# EAGLE design Controller Board (EAGLE 8.0.1)
CNAME: Rocket Igniter; CREVISION: 1.0; DESIGNER: J Hope
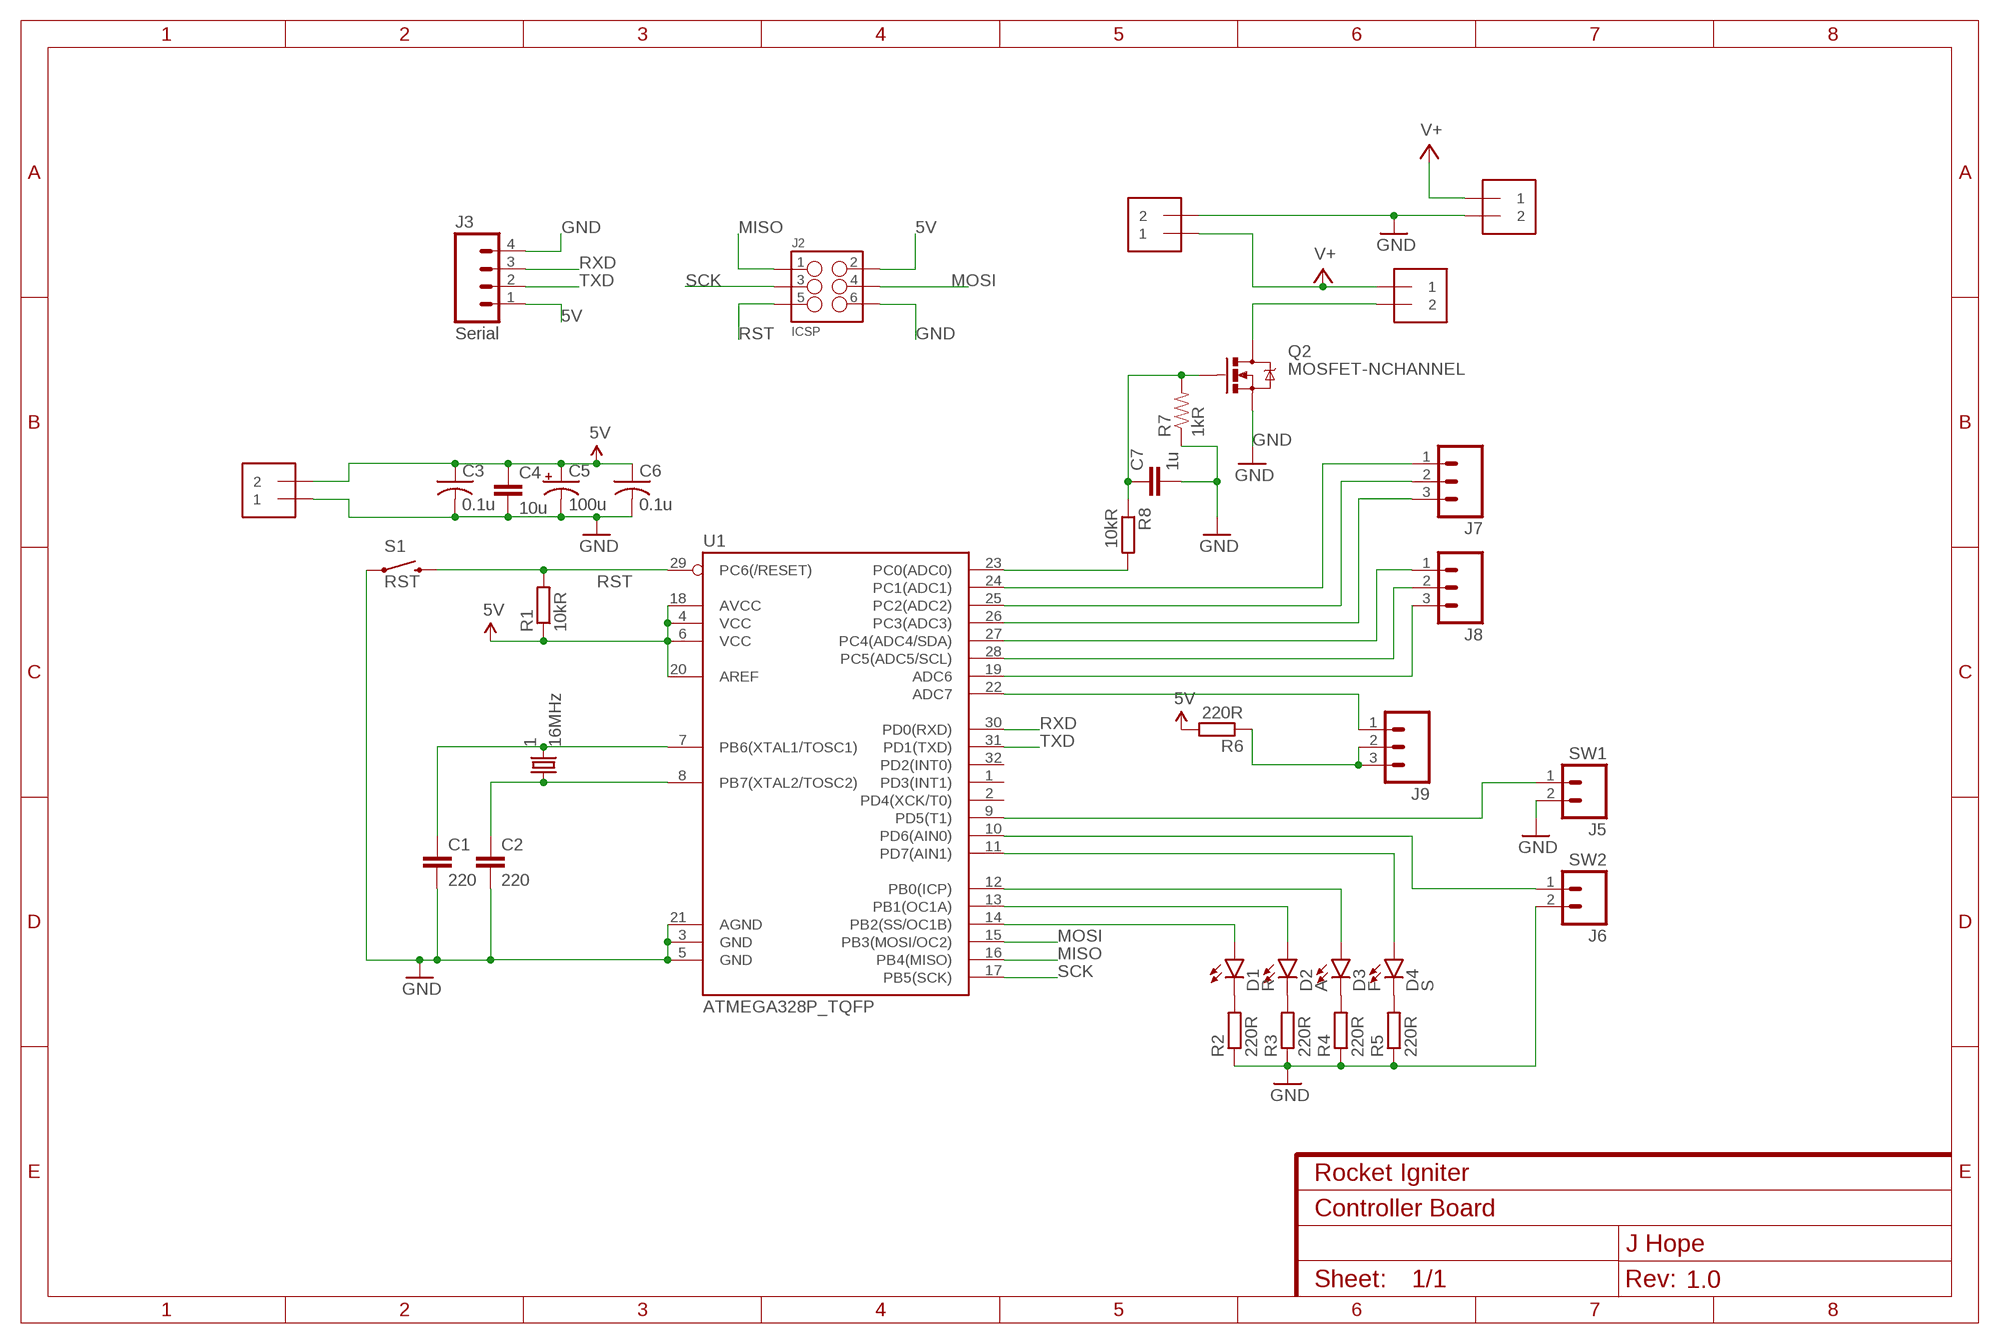
[diagram p0: schematic, sheet 1]

## Parts
1  16MHz  CRYSTAL4  [CRYSTAL-OSC-SMD-5X3.2]
C1  220  C-EUC0603  [C0603]
C2  220  C-EUC0603  [C0603]
C3  0.1u  C-USC0603  [C0603]
C4  10u  CAP0603-CAP  [0603-CAP]
C5  100u  CAP_POLD  [PANASONIC_D]
C6  0.1u  C-USC0603  [C0603]
C7  1u  CAP0603-CAP  [0603-CAP]
D1  R  LED5MM  [LED5MM]
D2  A  LED5MM  [LED5MM]
D3  F  LED5MM  [LED5MM]
D4  S  LED5MM  [LED5MM]
FAN  FAN  1X2-3.5MM  [1X2-3.5MM]
HV  HV  1X2-3.5MM  [1X2-3.5MM]
J2  ICSP  M03X22X3_SILK_MALE_PTH  [2X3]
J3  Serial  M04PTH  [1X04]
J5  SW1  M02SMALLPOLAR  [1X02_POLAR]
J6  SW2  M02SMALLPOLAR  [1X02_POLAR]
J7  M03PTH  [1X03]
J8  M03PTH  [1X03]
J9  M03PTH  [1X03]
POWER  +5V  1X2-3.5MM  [1X2-3.5MM]
Q2  MOSFET-NCHANNEL  MOSFET-NCHANNELFQP30N06L  [TO220V]
R1  10kR  R-EU_R0603  [R0603]
R2  220R  R-EU_R0603  [R0603]
R3  220R  R-EU_R0603  [R0603]
R4  220R  R-EU_R0603  [R0603]
R5  220R  R-EU_R0603  [R0603]
R6  220R  R-EU_R0603  [R0603]
R7  1kR  RESISTOR0603  [0603-RES]
R8  10kR  R-EU_R0603  [R0603]
S1  RST  SWITCH-MOMENTARY-2SMD-1101NE  [TACTILE-SWITCH-1101NE]
U1  ATMEGA328P_TQFP  [TQFP32-08]
V+  V+  1X2-3.5MM  [1X2-3.5MM]

## Nets
5V: C3.1 C4.1 C5.+ C6.1 J2.2 J3.1 POWER.2 R1.1 R6.2 U1.4(VCC) U1.6(VCC) U1.18(AVCC) U1.20(AREF)
A: J7.1 U1.24(PC1(ADC1))
B: J7.2 U1.25(PC2(ADC2))
C: J7.3 U1.26(PC3(ADC3))
D: J8.1 U1.27(PC4(ADC4/SDA))
E: J8.2 U1.28(PC5(ADC5/SCL))
F: J8.3 U1.19(ADC6)
G: J9.1 U1.22(ADC7)
GND: C1.2 C2.2 C3.2 C4.2 C5.- C6.2 C7.2 FAN.2 J2.6 J3.4 J5.2 J6.2 POWER.1 Q2.3(S) R2.1 R3.1 R4.1 R5.1 R7.1 S1.1 U1.3(GND) U1.5(GND) U1.21(AGND) V+.2
MISO: J2.1 U1.16(PB4(MISO))
MOSI: J2.4 U1.15(PB3(MOSI/OC2))
N$1: 1.3 C1.1 U1.7(PB6(XTAL1/TOSC1))
N$2: 1.1 C2.1 U1.8(PB7(XTAL2/TOSC2))
N$3: D1.K(C) R2.2
N$4: D2.K(C) R3.2
N$5: D3.K(C) R4.2
N$6: D1.A U1.14(PB2(SS/OC1B))
N$7: D2.A U1.13(PB1(OC1A))
N$8: D3.A U1.12(PB0(ICP))
N$9: R8.2 U1.23(PC0(ADC0))
N$10: C7.1 Q2.1(G) R7.2 R8.1
N$17: D4.K(C) R5.2
N$18: D4.A U1.11(PD7(AIN1))
N$19: HV.2 Q2.2(D)
N$20: J6.1 U1.10(PD6(AIN0))
N$21: J5.1 U1.9(PD5(T1))
N$27: J9.2 J9.3 R6.1
RST: J2.5 R1.2 S1.2 U1.29(PC6(/RESET))
RXD: J3.3 U1.30(PD0(RXD))
SCK: J2.3 U1.17(PB5(SCK))
TXD: J3.2 U1.31(PD1(TXD))
V+: FAN.1 HV.1 V+.1
Unconnected: U1.1(PD3(INT1)) U1.2(PD4(XCK/T0)) U1.32(PD2(INT0))

## Library data of the parts
1 = jameslbr:CRYSTAL
C1 C2 = resistor:C-EU: CAPACITOR, European symbol
C3 C6 = adafruit:C-US: CAPACITOR, American symbol
C4 C7 = SparkFun-Passives:CAP: Capacitor Standard 0603 ceramic capacitor, and 0.1" leaded capacitor.
C5 = SparkFun-Capacitors:CAP_POL: Capacitor Polarized These are standard SMD and PTH capacitors. Normally 10uF, 47uF, and 100uF in electrolytic and tantalum varieties. Always verify the external diameter of the through hole cap, it varies with capacity, voltage, and manufacturer. The EIA devices should be standard.
D1-D4 = SparkFun-LED:LED: LEDs Standard schematic elements and footprints for 5mm, 3mm, 1206, and 0603 sized LEDs. 5mm - Spark Fun Electronics SKU : COM-00529 (and others)
FAN HV POWER V+ = adafruit:1X2: 3.5mm Terminal block http://www.ladyada.net/library/pcb/eaglelibrary.html
J2 = SparkFun-Connectors:M03X2: 2x3 .1" header. Shrouded, with keying- CONN-10681 SMT- CONN-11415 Pogo pins- HW-11044; PROD_ID: CONN-09701
J3 = SparkFun-Connectors:M04: Header 4 Standard 4-pin 0.1" header. Use with straight break away headers (SKU : PRT-00116), right angle break away headers (PRT-00553), swiss pins (PRT-00743), machine pins (PRT-00117), and female headers (PRT-00115). Molex polarized connector foot print use with SKU : PRT-08231 with associated crimp pins and housings. 1MM SMD Version SKU: PRT-10208; PROD_ID: CONN-09696
J5 J6 = SparkFun-Connectors:M02: Standard 2-pin 0.1" header. Use with - straight break away headers ( PRT-00116) - right angle break away headers (PRT-00553) - swiss pins (PRT-00743) - machine pins (PRT-00117) - female headers (PRT-00115) Molex polarized connector foot print use with: PRT-08233 with associated crimp pins and housings. 2.54_SCREWTERM for use with PRT-10571. 3.5mm Screw Terminal footprints for PRT-08084 5mm Screw Terminal footprints for use with PRT-08432
J7-J9 = SparkFun-Connectors:M03: Header 3 Standard 3-pin 0.1" header. Use with straight break away headers (SKU : PRT-00116), right angle break away headers (PRT-00553), swiss pins (PRT-00743), machine pins (PRT-00117), and female headers (PRT-00115). Molex polarized connector foot print use with SKU : PRT-08232 with associated crimp pins and housings.
Q2 = SparkFun-DiscreteSemi:MOSFET-NCHANNEL: Common NMOSFET Parts MFG P/N Store ID Prod ID FDD8780 TRANS-09984 SI7820DN TRANS-11055 FDS6630A IC-08089 2N7002PW TRANS-11151 FQP30N06L COM-10213 TRANS-10060 BSS123LT1G TRANS-08345 BSS138 TRANS-00830 BS170 2N7000; PROD_ID: TRANS-10060
R1-R6 R8 = resistor:R-EU_: RESISTOR, European symbol
R7 = SparkFun-Resistors:RESISTOR: Resistor Basic schematic elements and footprints for 0603, 1206, and PTH resistors.
S1 = SparkFun-Electromechanical:SWITCH-MOMENTARY-2: Various NO switches- pushbuttons, reed, etc; PROD_ID: SWCH-00815
U1 = SparkFun-DigitalIC:ATMEGA328P_TQFP; PROD_ID: IC-09069

## Board
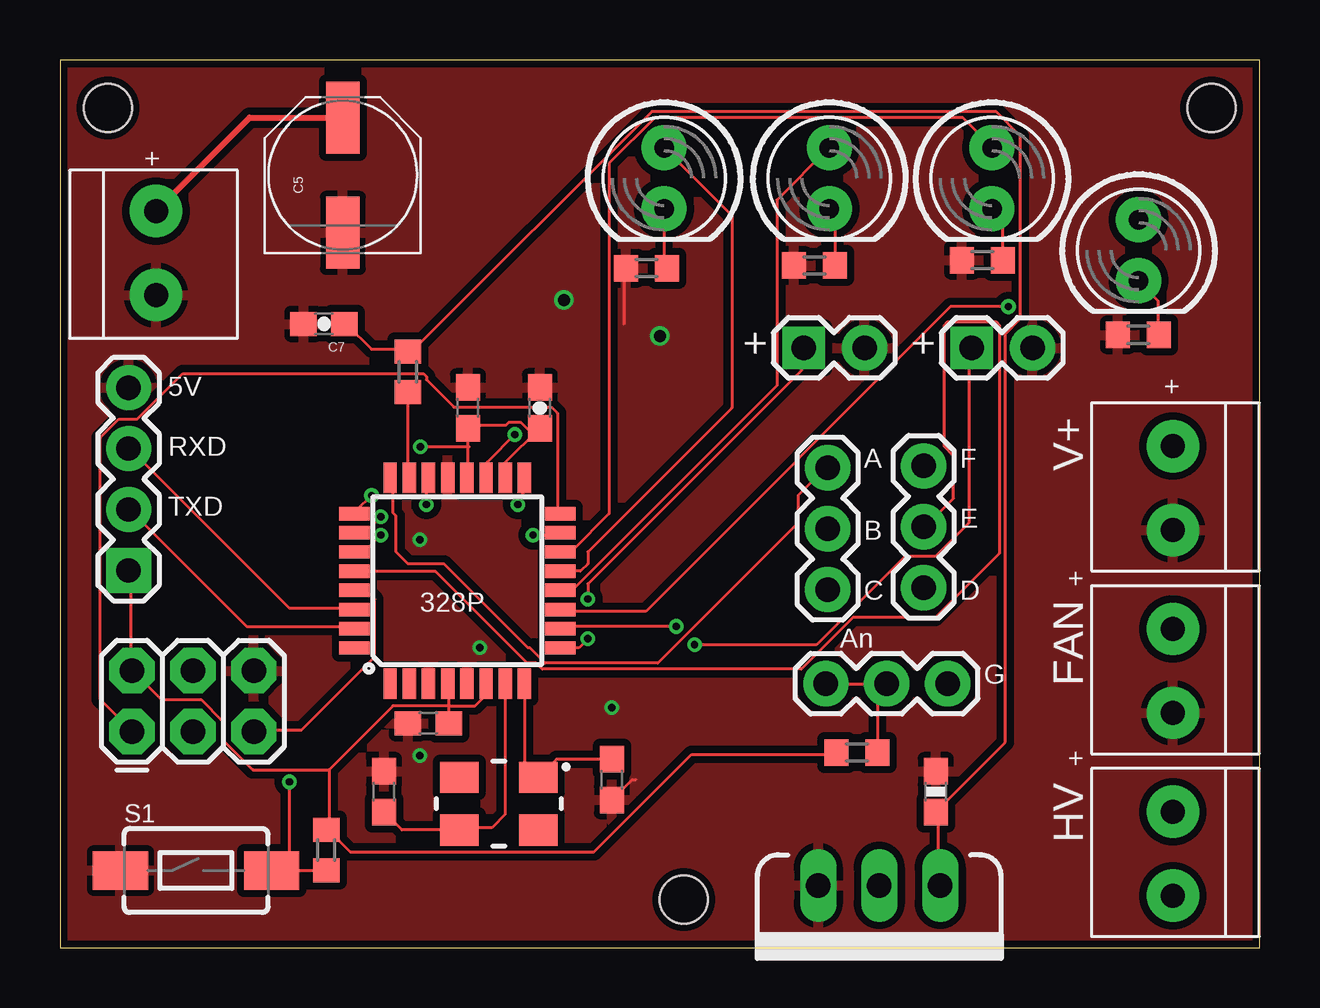
[diagram p1: board, top side]
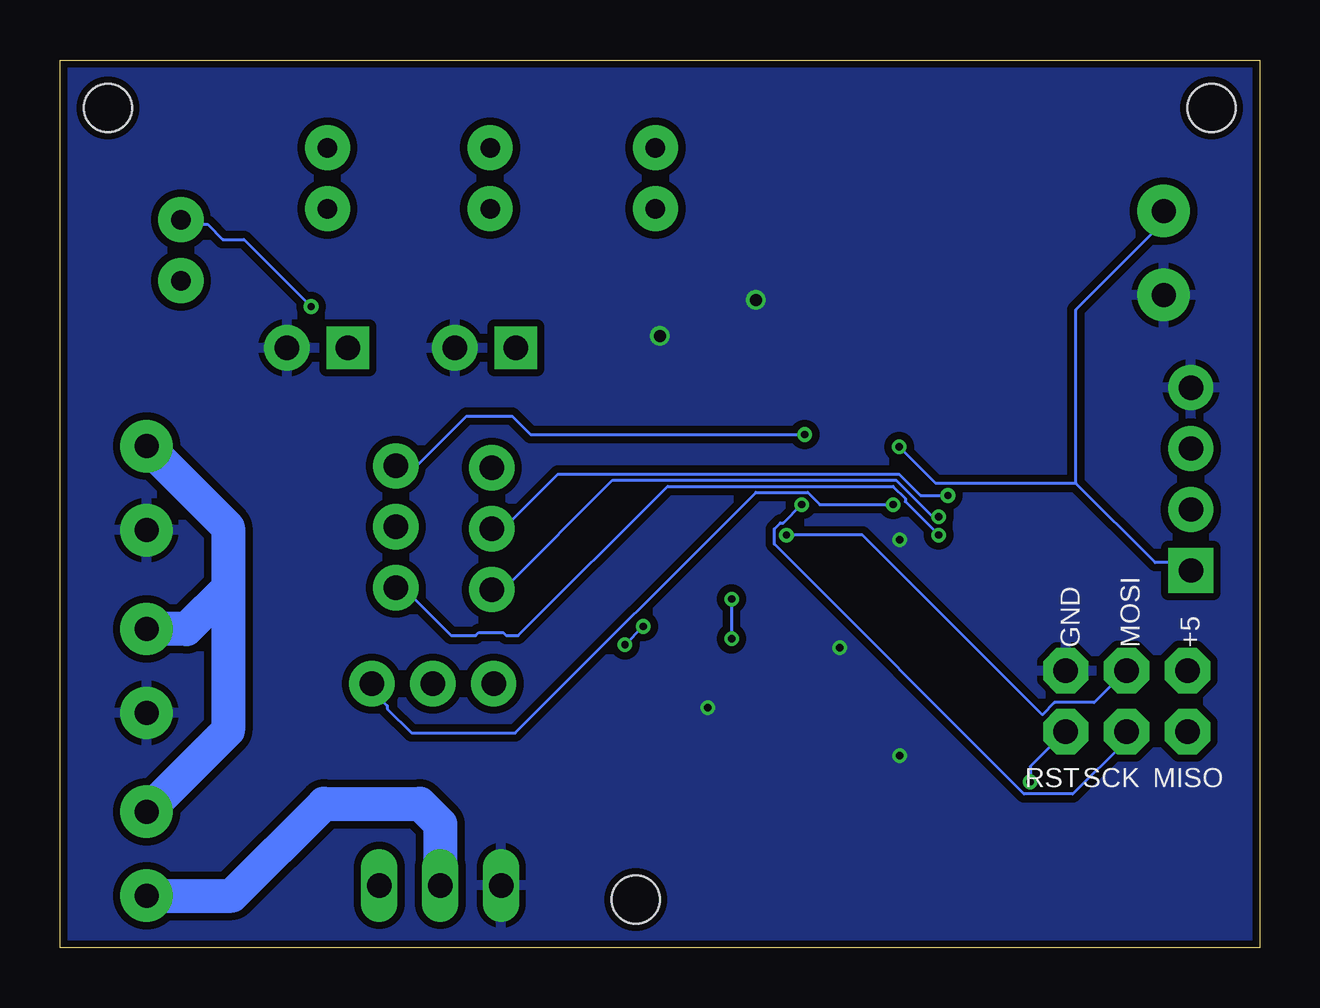
[diagram p2: board, bottom side, seen from below]

Size 50 x 37 mm. Coordinates in mm from the lower left corner, seen from the top.
Outline: 0,0 50,0 50,37 0,37 0,0
Copper layers (1*16): Top 0.035mm / dielectric 1.5mm / Bottom 0.035mm
Design rules "dirt_cheap_dirty_boards.v1": minimum track width 5mil, minimum drill 12mil, track to track 5mil, track to pad 5mil, pad to pad 5mil, via to via 5mil, smd to smd 0mil, copper to edge 10mil, drill to drill 10mil, minimum pad ring 10mil, minimum via ring 6mil, stop-mask expansion 2mil, vias tented up to drill 25mil, thermal gap 10mil
Holes 2 mm at 2,35 48,35 26,2

### Footprints (pad centres in the part's own frame; a part is rotated, then mirrored left to right if it is on the bottom)
CRYSTAL-OSC-SMD-5X3.2 = smd 1.6 x 1.3: 1 -1.65,-1.1; 2 1.65,-1.1; 3 1.65,1.1; 4 -1.65,1.1
C0603 = smd 1.1 x 1: 1 -0.85,0; 2 0.85,0
0603-CAP = smd 1.1 x 1: 1 -0.85,0; 2 0.85,0
PANASONIC_D = smd 3 x 1.4: + 2.4,0; - -2.4,0
LED5MM = drill 0.813 pad 1.88: A -1.27,0; K 1.27,0
1X2-3.5MM = drill 1 pad 2.184: 1 1.8,0; 2 -1.7,0
2X3 = drill 1.016 pad 1.88 octagon: 1 0,0; 2 0,2.54; 3 2.54,0; 4 2.54,2.54; 5 5.08,0; 6 5.08,2.54
1X04 = drill 1.016 pad 1.88 square: 1 0,0 | drill 1.016 pad 1.88: 2 2.54,0; 3 5.08,0; 4 7.62,0
1X02_POLAR = drill 1.016 pad 1.778 square: 1 0,0 | drill 1.016 pad 1.88: 2 2.54,0
1X03 = drill 1.016 pad 1.88: 1 0,0; 2 2.54,0; 3 5.08,0
TO220V = drill 1.016 long: 1 -2.54,0; 2 0,0; 3 2.54,0
R0603 = smd 1 x 1.1: 1 -0.85,0; 2 0.85,0
0603-RES = smd 1.1 x 1: 1 -0.85,0; 2 0.85,0
TACTILE-SWITCH-1101NE = smd 2.3 x 1.6: 1 -3.15,0; 2 3.15,0
TQFP32-08 = smd 1.27 x 0.559: 1 -4.293,2.8; 2 -4.293,2; 3 -4.293,1.2; 4 -4.293,0.4; 5 -4.293,-0.4; 6 -4.293,-1.2; 7 -4.293,-2; 8 -4.293,-2.8; 17 4.293,-2.8; 18 4.293,-2; 19 4.293,-1.2; 20 4.293,-0.4; 21 4.293,0.4; 22 4.293,1.2; 23 4.293,2; 24 4.293,2.8 | smd 0.559 x 1.27: 9 -2.8,-4.293; 10 -2,-4.293; 11 -1.2,-4.293; 12 -0.4,-4.293; 13 0.4,-4.293; 14 1.2,-4.293; 15 2,-4.293; 16 2.8,-4.293; 25 2.8,4.293; 26 2,4.293; 27 1.2,4.293; 28 0.4,4.293; 29 -0.4,4.293; 30 -1.2,4.293; 31 -2,4.293; 32 -2.8,4.293

### Placement (x,y rotation side)
1  18.29,6 180 top
C1  13.5,6.5 90 top
C2  23,7 270 top
C3  17,22.5 90 top
C4  20,22.5 90 top
C5  11.79,32.2 90 top
C6  15.35,9.35 180 top
C7  11,26 180 top
D1  38.85,32.07 270 top
D2  25.18,32.07 270 top
D3  32.07,32.07 270 top
D4  44.96,29.07 270 top
FAN  46.39,11.48 90 top
HV  46.39,3.86 90 top
J2  3,9 0 top
J3  2.86,15.72 90 top
J5  31,25 0 top
J6  38,25 0 top
J7  32,20 270 top
J8  36,15 90 top
J9  37,11 180 top
POWER  4,29 270 top
Q2  34.15,2.59 180 top
R1  11.1,4.06 270 top
R2  38.45,28.65 0 top
R3  24.45,28.32 0 top
R4  31.45,28.43 0 top
R5  44.95,25.54 0 top
R6  33.22,8.13 180 top
R7  36.5,6.5 270 top
R8  14.5,24 270 top
S1  5.67,3.21 0 top
U1  16.56,15.29 90 top
V+  46.39,19.1 90 top

### Tracks (layer width: path | path; a pad name or v marks a point on that pad's centre or on a via)
5V  (via drill 0.3)
  Top 0.127: U1.20 17,19.58 17,20.88 | 17,20.88 C3.1 17.05,21.77 18.58,21.77 18.7,21.89 19.21,21.89 19.72,21.39 C4.1 18.56,20.21 U1.18 | U1.4 16.2,10.95 16.2,10.08 | 16.2,10.08 C6.1 | 11.21,7.42 11.21,5 R1.1 11.21,4.88 12.1,3.99 22.26,3.99 26.32,8.05 32.29,8.05 R6.2 | 11.21,7.42 13.88,10.08 16.16,10.08 16.2,10.08 | 16.2,10.08 17.31,10.08 17.69,10.46 17.69,10.97 U1.6 | v15.02,20.88 17,20.88 | 17.05,20.88 17,20.88 | J3.1 2.96,15.67 2.96,11.61 J2.2 3.08,11.48 4.23,10.34 5.88,10.34 6.77,9.45 6.77,8.69 8.04,7.42 11.21,7.42
  Top 0.254: POWER.2 7.9,34.6 C5.+
  Bottom 0.127: v15.02,20.88 13.5,19.35 7.66,19.35 | 7.66,19.35 4.35,16.05 3.21,16.05 2.96,15.8 J3.1 | 7.66,19.35 7.66,26.59 4.1,30.15 4.1,30.66 POWER.2
A
  Top 0.127: U1.24 13.88,19.48 13.88,18.12 14,18 14,16.5 14.5,16 16,16 19.5,12.5 19.59,12.5 20.23,11.86 24.93,11.86 30.77,17.7 30.77,18.85 31.91,19.99 J7.1
B  (via drill 0.3)
  Top 0.127: v12.99,18.85 12.35,18.21 U1.25
  Bottom 0.127: v12.99,18.85 14.13,18.85 15.02,19.73 29.24,19.73 31.4,17.58 31.91,17.58 J7.2
C  (via drill 0.3)
  Top 0.127: v13.37,17.96 12.73,17.32 12.35,17.32 U1.26
  Bottom 0.127: v13.37,17.96 13.62,17.96 15.15,19.48 26.96,19.48 31.4,15.04 31.91,15.04 J7.3
D  (via drill 0.3)
  Top 0.127: v13.37,17.2 12.73,16.56 12.35,16.56 U1.27
  Bottom 0.127: v13.37,17.2 14.77,18.59 14.77,18.72 15.27,19.23 24.67,19.23 30.9,13 31.4,13 31.53,13.13 32.55,13.13 32.67,13 33.69,13 35.59,14.91 35.98,14.91 J8.1
E
  Top 0.127: U1.28 12.35,15.67 15.66,15.67 19.47,11.86 19.85,11.86 20.1,11.61 30.9,11.61 33.05,13.77 36.48,13.77 39.15,16.43 39.15,25.96 39.02,26.09 36.99,26.09 36.87,25.96 36.87,20.88 37.25,20.5 37.25,18.72 36.1,17.58 J8.2
F  (via drill 0.3)
  Top 0.127: v18.96,21.39 17.81,20.24 17.81,19.61 U1.19
  Bottom 0.127: v18.96,21.39 30.39,21.39 31.15,22.15 33.05,22.15 35.09,20.12 35.98,20.12 J8.3
G  (via drill 0.3)
  Top 0.127: v15.27,18.47 15.27,19.48 U1.22
  Bottom 0.127: v15.27,18.47 18.32,18.47 18.83,18.97 20.99,18.97 31.02,8.94 35.34,8.94 36.36,9.96 36.36,10.08 36.99,10.72 36.99,10.97 J9.1
GND  (via drill 0.3, 0.5)
  Top 0.127: R3.1 23.5,28.22 23.5,26 | C2.2 23.85,7 24,7
  other vias: 21,27 25,25.5 17.5,12.5 23,10 15,8 15,17
  pour Bottom (isolate 0.305): 0,37 50,37 50,0 0,0
  pour Top (isolate 0.305): 0,37 50,37 50,0 0,0
MISO
  Top 0.127: U1.16 20.74,18.21 20.74,22.27 20.48,22.53 16.42,22.53 15.27,23.67 15.27,23.8 15.15,23.93 5.11,23.93 3.21,22.02 2.45,22.02 1.69,21.26 1.69,10.34 2.96,9.07 J2.1
MOSI  (via drill 0.3)
  Top 0.127: v19.72,17.2 20.74,17.2 U1.15
  Bottom 0.127: v19.72,17.2 16.55,17.2 9.05,9.7 8.54,10.21 6.89,10.21 5.62,11.48 J2.4
N$1
  Top 0.127: U1.7 18.56,5.56 18,5 16.74,5 1.3 14.25,4.9 C1.1
N$2
  Top 0.127: U1.8 19.36,7.68 1.1 20.69,7.85 C2.1
N$3
  Top 0.127: R2.2 39.28,28.75 39.28,30.4 38.9,30.78 D1.K
N$4
  Top 0.127: R3.2 25.18,28.37 25.18,30.78 D2.K
N$5
  Top 0.127: R4.2 32.29,28.5 32.29,30.66 32.17,30.78 D3.K
N$6
  Top 0.127: U1.14 20.86,16.56 21.37,16.56 22.9,18.08 22.9,32.69 24.8,34.59 37.63,34.59 38.77,33.45 D1.A
N$7
  Top 0.127: D2.A 28,30.52 28,22.5 22,16.5 22,16 21.69,15.69 U1.13
N$8
  Top 0.127: U1.12 20.86,14.91 21.37,14.91 29.88,23.42 29.88,31.16 32.04,33.32 D3.A
N$9
  Top 0.127: R8.2 14.51,23.04 14.51,19.61 U1.23
N$10
  Top 0.127: C7.1 11.97,25.96 12.99,24.94 14.39,24.94 R8.1 14.51,24.94 14.77,24.94 24.67,34.85 39.02,34.85 40.04,33.83 40.04,26.21 39.41,25.58 39.41,8.56 36.61,5.77 R7.2 36.61,5.64 36.61,2.59 Q2.1
N$17
  Top 0.127: R5.2 45.75,25.58 45.75,26.97 44.99,27.74 D4.K
N$18  (via drill 0.3)
  Top 0.127: v39.53,26.72 37.12,26.72 24.42,14.02 20.86,14.02 U1.11
  Bottom 0.127: v39.53,26.72 42.33,29.51 43.22,29.51 43.85,30.15 44.74,30.15 44.87,30.28 D4.A
N$19
  Bottom 1.422: HV.2 42.84,2.16 39,6 35,6 34.15,5.15 Q2.2
N$20  (via drill 0.3)
  Top 0.127: v25.69,13.38 20.86,13.38 U1.10 | v26.45,12.62 31.53,12.62 35.21,16.31 36.48,16.31 37.88,17.7 37.88,24.94 J6.1
  Bottom 0.127: v26.45,12.62 v25.69,13.38
N$21  (via drill 0.3)
  Top 0.127: v22.01,12.88 21.62,12.5 20.86,12.5 U1.9 | v22.01,14.53 22.01,15.16 30.9,24.05 30.9,24.94 J5.1
  Bottom 0.127: v22.01,14.53 v22.01,12.88
N$27
  Top 0.127: 34.07,10.59 34.07,8.18 R6.1 | 34.07,10.59 34.45,10.97 J9.2 34.07,10.59 | 34.07,10.59 33.69,10.97 32.04,10.97 J9.3
RST  (via drill 0.3)
  Top 0.127: 9.56,3.23 8.92,3.23 S1.2 9.56,3.23 | 9.56,3.23 11.08,3.23 R1.2 | U1.29 12.35,14.78 12.86,14.78 13.12,14.53 13.12,12.11 10.07,9.07 8.16,9.07 J2.5 | v9.56,6.91 9.56,3.23
  Bottom 0.127: v9.56,6.91 9.56,7.54 8.16,8.94 J2.5
RXD
  Top 0.127: U1.30 12.23,14.15 9.56,14.15 2.96,20.75 J3.3
SCK  (via drill 0.3)
  Top 0.127: v19.09,18.47 19.09,18.72 19.34,18.97 19.34,19.48 U1.17
  Bottom 0.127: v19.09,18.47 19.85,17.7 19.97,17.7 20.23,17.45 20.23,16.81 9.81,6.4 7.78,6.4 5.62,8.56 5.62,8.94 J2.3
TXD
  Top 0.127: U1.31 12.23,13.38 7.78,13.38 2.96,18.21 J3.2
V+
  Bottom 1.422: V+.1 43,17.51 43,15 | 43,15 44.72,13.28 FAN.1 | 43,15 43,9.05 HV.1

### Text on the board
tNames: + | 5V | + | RXD | A | F | TXD | B | E | C | D | D | + | 328P | An | G | +
bNames: +5 | MOSI | GND | MISO | SCK | RST